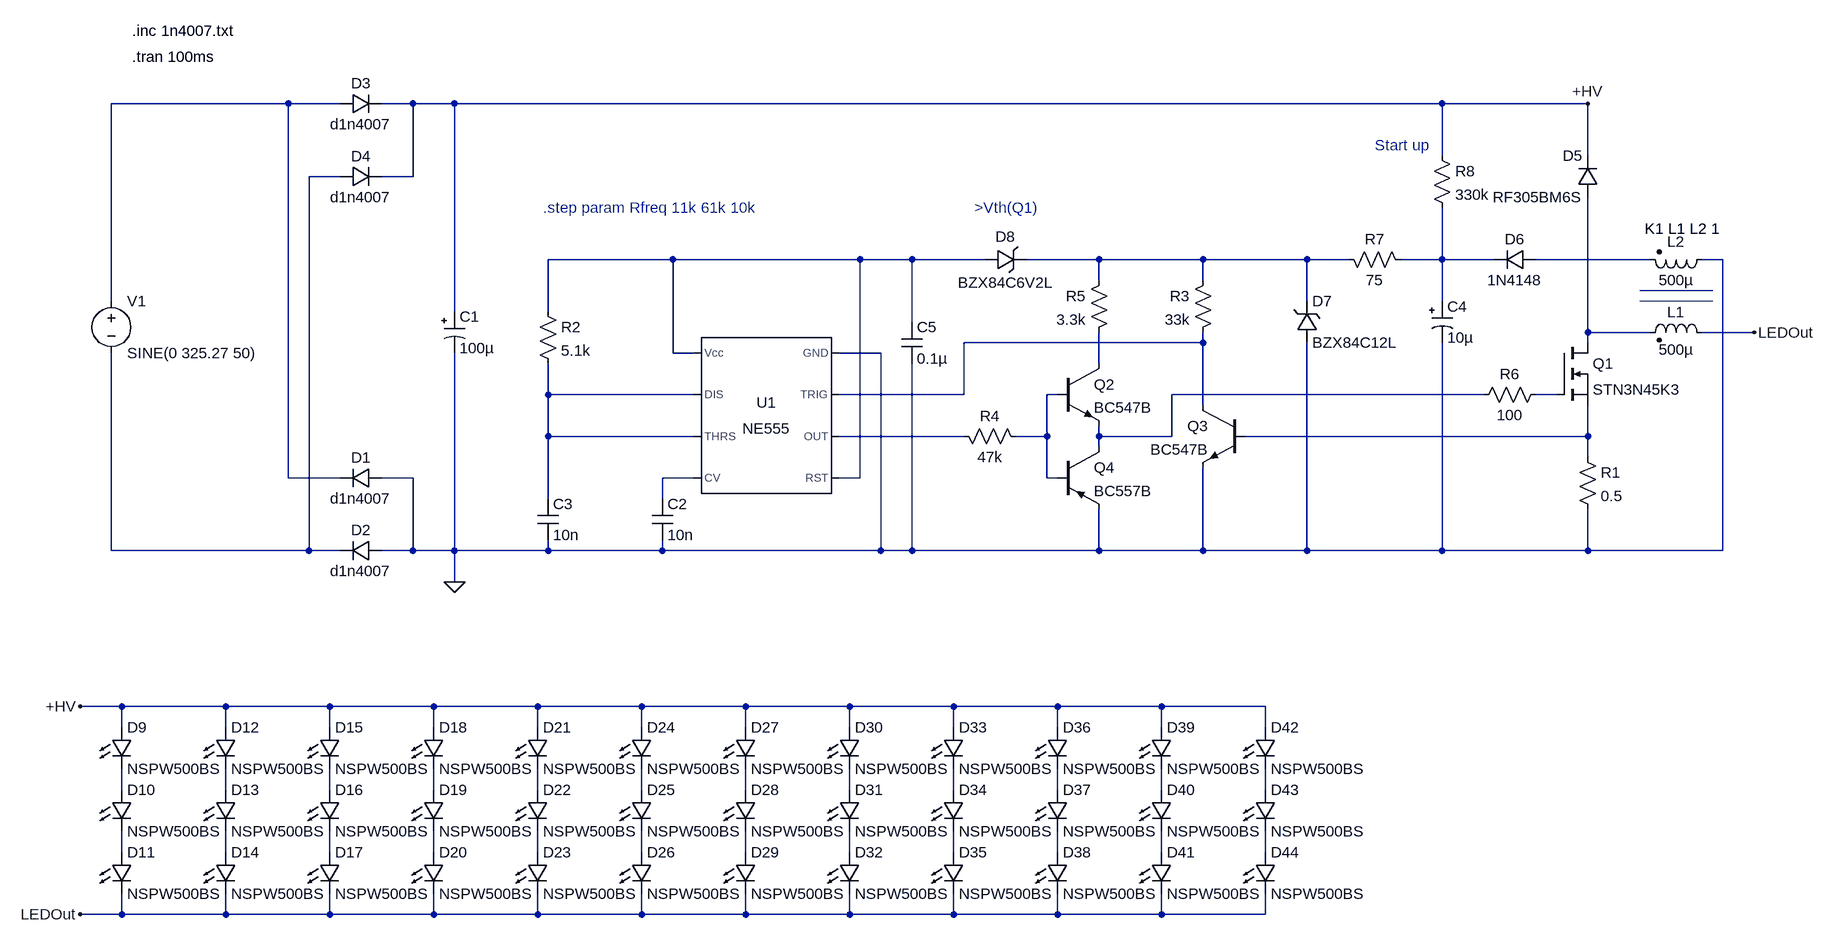
[diagram p0: schematic AC LED Driver LoV.asc]
AC LED Driver LoV.asc, the LTspice schematic file:
Version 4
SHEET 1 4020 1492
WIRE 736 -16 464 -16
WIRE 816 -16 736 -16
WIRE 928 -16 880 -16
WIRE 992 -16 928 -16
WIRE 2512 -16 992 -16
WIRE 2736 -16 2512 -16
WIRE 2512 64 2512 -16
WIRE 2736 64 2736 -16
WIRE 816 96 768 96
WIRE 928 96 928 -16
WIRE 928 96 880 96
WIRE 1328 224 1136 224
WIRE 1616 224 1328 224
WIRE 1696 224 1616 224
WIRE 1808 224 1696 224
WIRE 1984 224 1872 224
WIRE 2144 224 1984 224
WIRE 2304 224 2144 224
WIRE 2368 224 2304 224
WIRE 2512 224 2512 144
WIRE 2512 224 2448 224
WIRE 2592 224 2512 224
WIRE 2832 224 2656 224
WIRE 2944 224 2912 224
WIRE 1984 256 1984 224
WIRE 2144 256 2144 224
WIRE 464 288 464 -16
WIRE 2304 288 2304 224
WIRE 2512 288 2512 224
WIRE 992 304 992 -16
WIRE 1136 304 1136 224
WIRE 1696 320 1696 224
WIRE 2736 336 2736 128
WIRE 2832 336 2736 336
WIRE 2992 336 2912 336
WIRE 2144 352 2144 336
WIRE 2144 352 1776 352
WIRE 2736 352 2736 336
WIRE 1328 368 1328 224
WIRE 1360 368 1328 368
WIRE 1648 368 1584 368
WIRE 1984 384 1984 336
WIRE 1136 432 1136 384
WIRE 1360 432 1136 432
WIRE 1776 432 1776 352
WIRE 1776 432 1584 432
WIRE 1920 432 1904 432
WIRE 2576 432 2096 432
WIRE 2688 432 2656 432
WIRE 2144 448 2144 352
WIRE 1136 496 1136 432
WIRE 1360 496 1136 496
WIRE 1776 496 1584 496
WIRE 1904 496 1904 432
WIRE 1904 496 1856 496
WIRE 1984 496 1984 480
WIRE 2096 496 2096 432
WIRE 2096 496 1984 496
WIRE 2736 496 2736 448
WIRE 2736 496 2208 496
WIRE 1984 512 1984 496
WIRE 2736 528 2736 496
WIRE 736 560 736 -16
WIRE 816 560 736 560
WIRE 928 560 880 560
WIRE 1360 560 1312 560
WIRE 1616 560 1616 224
WIRE 1616 560 1584 560
WIRE 1904 560 1904 496
WIRE 1920 560 1904 560
WIRE 1136 592 1136 496
WIRE 1312 592 1312 560
WIRE 464 672 464 368
WIRE 768 672 768 96
WIRE 768 672 464 672
WIRE 816 672 768 672
WIRE 928 672 928 560
WIRE 928 672 880 672
WIRE 992 672 992 368
WIRE 992 672 928 672
WIRE 1136 672 1136 656
WIRE 1136 672 992 672
WIRE 1312 672 1312 656
WIRE 1312 672 1136 672
WIRE 1648 672 1648 368
WIRE 1648 672 1312 672
WIRE 1696 672 1696 384
WIRE 1696 672 1648 672
WIRE 1984 672 1984 608
WIRE 1984 672 1696 672
WIRE 2144 672 2144 544
WIRE 2144 672 1984 672
WIRE 2304 672 2304 352
WIRE 2304 672 2144 672
WIRE 2512 672 2512 352
WIRE 2512 672 2304 672
WIRE 2736 672 2736 608
WIRE 2736 672 2512 672
WIRE 2944 672 2944 224
WIRE 2944 672 2736 672
WIRE 992 720 992 672
WIRE 480 912 416 912
WIRE 640 912 480 912
WIRE 800 912 640 912
WIRE 960 912 800 912
WIRE 1120 912 960 912
WIRE 1280 912 1120 912
WIRE 1440 912 1280 912
WIRE 1600 912 1440 912
WIRE 1760 912 1600 912
WIRE 1920 912 1760 912
WIRE 2080 912 1920 912
WIRE 2240 912 2080 912
WIRE 480 944 480 912
WIRE 640 944 640 912
WIRE 800 944 800 912
WIRE 960 944 960 912
WIRE 1120 944 1120 912
WIRE 1280 944 1280 912
WIRE 1440 944 1440 912
WIRE 1600 944 1600 912
WIRE 1760 944 1760 912
WIRE 1920 944 1920 912
WIRE 2080 944 2080 912
WIRE 2240 944 2240 912
WIRE 480 1040 480 1008
WIRE 640 1040 640 1008
WIRE 800 1040 800 1008
WIRE 960 1040 960 1008
WIRE 1120 1040 1120 1008
WIRE 1280 1040 1280 1008
WIRE 1440 1040 1440 1008
WIRE 1600 1040 1600 1008
WIRE 1760 1040 1760 1008
WIRE 1920 1040 1920 1008
WIRE 2080 1040 2080 1008
WIRE 2240 1040 2240 1008
WIRE 480 1136 480 1104
WIRE 640 1136 640 1104
WIRE 800 1136 800 1104
WIRE 960 1136 960 1104
WIRE 1120 1136 1120 1104
WIRE 1280 1136 1280 1104
WIRE 1440 1136 1440 1104
WIRE 1600 1136 1600 1104
WIRE 1760 1136 1760 1104
WIRE 1920 1136 1920 1104
WIRE 2080 1136 2080 1104
WIRE 2240 1136 2240 1104
WIRE 480 1232 480 1200
WIRE 480 1232 416 1232
WIRE 640 1232 640 1200
WIRE 640 1232 480 1232
WIRE 800 1232 800 1200
WIRE 800 1232 640 1232
WIRE 960 1232 960 1200
WIRE 960 1232 800 1232
WIRE 1120 1232 1120 1200
WIRE 1120 1232 960 1232
WIRE 1280 1232 1280 1200
WIRE 1280 1232 1120 1232
WIRE 1440 1232 1440 1200
WIRE 1440 1232 1280 1232
WIRE 1600 1232 1600 1200
WIRE 1600 1232 1440 1232
WIRE 1760 1232 1760 1200
WIRE 1760 1232 1600 1232
WIRE 1920 1232 1920 1200
WIRE 1920 1232 1760 1232
WIRE 2080 1232 2080 1200
WIRE 2080 1232 1920 1232
WIRE 2240 1232 2240 1200
WIRE 2240 1232 2080 1232
FLAG 992 720 0
FLAG 416 912 +HV
FLAG 416 1232 LEDOut
FLAG 2736 -16 +HV
FLAG 2992 336 LEDOut
SYMBOL voltage 464 272 R0
WINDOW 123 0 0 Left 2
WINDOW 39 0 0 Left 2
SYMATTR InstName V1
SYMATTR Value SINE(0 325.27 50)
SYMBOL diode 880 544 R90
WINDOW 0 0 32 VBottom 2
WINDOW 3 32 32 VTop 2
SYMATTR InstName D1
SYMATTR Value d1n4007
SYMBOL diode 880 656 R90
WINDOW 0 0 32 VBottom 2
WINDOW 3 32 32 VTop 2
SYMATTR InstName D2
SYMATTR Value d1n4007
SYMBOL diode 816 0 R270
WINDOW 0 32 32 VTop 2
WINDOW 3 0 32 VBottom 2
SYMATTR InstName D3
SYMATTR Value d1n4007
SYMBOL diode 816 112 R270
WINDOW 0 32 32 VTop 2
WINDOW 3 0 32 VBottom 2
SYMATTR InstName D4
SYMATTR Value d1n4007
SYMBOL polcap 976 304 R0
SYMATTR InstName C1
SYMATTR Value 100µ
SYMBOL nmos 2688 352 R0
SYMATTR InstName Q1
SYMATTR Value STN3N45K3
SYMBOL ind2 2928 352 M270
WINDOW 0 32 56 VTop 2
WINDOW 3 5 56 VBottom 2
SYMATTR InstName L1
SYMATTR Value 500µ
SYMATTR Type ind
SYMBOL diode 2752 128 R180
WINDOW 0 24 64 Left 2
WINDOW 3 24 0 Left 2
SYMATTR InstName D5
SYMATTR Value RF305BM6S
SYMBOL res 2720 512 R0
SYMATTR InstName R1
SYMATTR Value 0.5
SYMBOL npn 1920 384 R0
SYMATTR InstName Q2
SYMATTR Value BC547B
SYMBOL cap 1296 592 R0
SYMATTR InstName C2
SYMATTR Value 10n
SYMBOL cap 1120 592 R0
SYMATTR InstName C3
SYMATTR Value 10n
SYMBOL res 1120 288 R0
SYMATTR InstName R2
SYMATTR Value 5.1k
SYMBOL npn 2208 448 M0
SYMATTR InstName Q3
SYMATTR Value BC547B
SYMBOL res 2160 240 M0
SYMATTR InstName R3
SYMATTR Value 33k
SYMBOL res 1760 480 M90
WINDOW 0 0 56 VBottom 2
WINDOW 3 32 56 VTop 2
SYMATTR InstName R4
SYMATTR Value 47k
SYMBOL res 2000 240 M0
SYMATTR InstName R5
SYMATTR Value 3.3k
SYMBOL res 2560 448 R270
WINDOW 0 32 56 VTop 2
WINDOW 3 0 56 VBottom 2
SYMATTR InstName R6
SYMATTR Value 100
SYMBOL Misc\\NE555 1472 464 M0
SYMATTR InstName U1
SYMBOL ind2 2928 208 R90
WINDOW 0 4 56 VBottom 2
WINDOW 3 32 56 VTop 2
SYMATTR InstName L2
SYMATTR Value 500µ
SYMATTR Type ind
SYMBOL diode 2656 208 R90
WINDOW 0 0 32 VBottom 2
WINDOW 3 32 32 VTop 2
SYMATTR InstName D6
SYMATTR Value 1N4148
SYMBOL polcap 2496 288 R0
SYMATTR InstName C4
SYMATTR Value 10µ
SYMBOL res 2464 240 M270
WINDOW 0 32 56 VTop 2
WINDOW 3 0 56 VBottom 2
SYMATTR InstName R7
SYMATTR Value 75
SYMBOL zener 2288 352 M180
WINDOW 0 24 64 Left 2
WINDOW 3 24 0 Left 2
SYMATTR InstName D7
SYMATTR Value BZX84C12L
SYMBOL res 2496 48 R0
SYMATTR InstName R8
SYMATTR Value 330k
SYMBOL zener 1808 208 M90
WINDOW 0 -4 32 VBottom 2
WINDOW 3 36 32 VTop 2
SYMATTR InstName D8
SYMATTR Value BZX84C6V2L
SYMBOL cap 1680 320 R0
SYMATTR InstName C5
SYMATTR Value 0.1µ
SYMBOL LED 464 944 R0
SYMATTR InstName D9
SYMATTR Value NSPW500BS
SYMBOL LED 464 1040 R0
SYMATTR InstName D10
SYMATTR Value NSPW500BS
SYMBOL LED 464 1136 R0
SYMATTR InstName D11
SYMATTR Value NSPW500BS
SYMBOL LED 624 944 R0
SYMATTR InstName D12
SYMATTR Value NSPW500BS
SYMBOL LED 624 1040 R0
SYMATTR InstName D13
SYMATTR Value NSPW500BS
SYMBOL LED 624 1136 R0
SYMATTR InstName D14
SYMATTR Value NSPW500BS
SYMBOL LED 784 944 R0
SYMATTR InstName D15
SYMATTR Value NSPW500BS
SYMBOL LED 784 1040 R0
SYMATTR InstName D16
SYMATTR Value NSPW500BS
SYMBOL LED 784 1136 R0
SYMATTR InstName D17
SYMATTR Value NSPW500BS
SYMBOL LED 944 944 R0
SYMATTR InstName D18
SYMATTR Value NSPW500BS
SYMBOL LED 944 1040 R0
SYMATTR InstName D19
SYMATTR Value NSPW500BS
SYMBOL LED 944 1136 R0
SYMATTR InstName D20
SYMATTR Value NSPW500BS
SYMBOL LED 1104 944 R0
SYMATTR InstName D21
SYMATTR Value NSPW500BS
SYMBOL LED 1104 1040 R0
SYMATTR InstName D22
SYMATTR Value NSPW500BS
SYMBOL LED 1104 1136 R0
SYMATTR InstName D23
SYMATTR Value NSPW500BS
SYMBOL LED 1264 944 R0
SYMATTR InstName D24
SYMATTR Value NSPW500BS
SYMBOL LED 1264 1040 R0
SYMATTR InstName D25
SYMATTR Value NSPW500BS
SYMBOL LED 1264 1136 R0
SYMATTR InstName D26
SYMATTR Value NSPW500BS
SYMBOL LED 1424 944 R0
SYMATTR InstName D27
SYMATTR Value NSPW500BS
SYMBOL LED 1424 1040 R0
SYMATTR InstName D28
SYMATTR Value NSPW500BS
SYMBOL LED 1424 1136 R0
SYMATTR InstName D29
SYMATTR Value NSPW500BS
SYMBOL LED 1584 944 R0
SYMATTR InstName D30
SYMATTR Value NSPW500BS
SYMBOL LED 1584 1040 R0
SYMATTR InstName D31
SYMATTR Value NSPW500BS
SYMBOL LED 1584 1136 R0
SYMATTR InstName D32
SYMATTR Value NSPW500BS
SYMBOL LED 1744 944 R0
SYMATTR InstName D33
SYMATTR Value NSPW500BS
SYMBOL LED 1744 1040 R0
SYMATTR InstName D34
SYMATTR Value NSPW500BS
SYMBOL LED 1744 1136 R0
SYMATTR InstName D35
SYMATTR Value NSPW500BS
SYMBOL LED 1904 944 R0
SYMATTR InstName D36
SYMATTR Value NSPW500BS
SYMBOL LED 1904 1040 R0
SYMATTR InstName D37
SYMATTR Value NSPW500BS
SYMBOL LED 1904 1136 R0
SYMATTR InstName D38
SYMATTR Value NSPW500BS
SYMBOL LED 2064 944 R0
SYMATTR InstName D39
SYMATTR Value NSPW500BS
SYMBOL LED 2064 1040 R0
SYMATTR InstName D40
SYMATTR Value NSPW500BS
SYMBOL LED 2064 1136 R0
SYMATTR InstName D41
SYMATTR Value NSPW500BS
SYMBOL LED 2224 944 R0
SYMATTR InstName D42
SYMATTR Value NSPW500BS
SYMBOL LED 2224 1040 R0
SYMATTR InstName D43
SYMATTR Value NSPW500BS
SYMBOL LED 2224 1136 R0
SYMATTR InstName D44
SYMATTR Value NSPW500BS
SYMBOL pnp 1920 512 R0
SYMATTR InstName Q4
SYMATTR Value BC557B
TEXT 496 -88 Left 2 !.tran 100ms
TEXT 496 -128 Left 2 !.inc 1n4007.txt
TEXT 2824 176 Left 2 !K1 L1 L2 1
TEXT 1128 144 Left 2 ;.step param Rfreq 11k 61k 10k
TEXT 1792 144 Left 2 ;>Vth(Q1)
TEXT 2408 48 Left 2 ;Start up
LINE Normal 2928 272 2816 272
LINE Normal 2928 288 2816 288

The netlist it stands for:
* AC LED Driver LoV.asc
V1 N001 N002 SINE(0 325.27 50)
D1 0 N001 d1n4007
D2 0 N002 d1n4007
D3 N001 +HV d1n4007
D4 N002 +HV d1n4007
C1 +HV 0 100µ
M§Q1 N007 N013 N015 N015 STN3N45K3
L1 LEDOut N007 500µ
D5 N007 +HV RF305BM6S
R1 N015 0 0.5
Q2 N009 N011 N012 0 BC547B
C2 N016 0 10n
C3 N010 0 10n
R2 N003 N010 5.1k
Q3 N008 N015 0 0 BC547B
R3 N004 N008 33k
R4 N014 N011 47k
R5 N004 N009 3.3k
R6 N012 N013 100
XU1 0 N008 N014 N003 N016 N010 N010 N003 NE555  ; pins GND TRIG OUT RST CV THRS DIS Vcc
L2 0 N006 500µ
D6 N006 N005 1N4148
C4 N005 0 10µ
R7 N005 N004 75
D7 0 N004 BZX84C12L
R8 +HV N005 330k
D8 N003 N004 BZX84C6V2L
C5 N003 0 0.1µ
D9 +HV N017 NSPW500BS
D10 N017 N029 NSPW500BS
D11 N029 LEDOut NSPW500BS
D12 +HV N018 NSPW500BS
D13 N018 N030 NSPW500BS
D14 N030 LEDOut NSPW500BS
D15 +HV N019 NSPW500BS
D16 N019 N031 NSPW500BS
D17 N031 LEDOut NSPW500BS
D18 +HV N020 NSPW500BS
D19 N020 N032 NSPW500BS
D20 N032 LEDOut NSPW500BS
D21 +HV N021 NSPW500BS
D22 N021 N033 NSPW500BS
D23 N033 LEDOut NSPW500BS
D24 +HV N022 NSPW500BS
D25 N022 N034 NSPW500BS
D26 N034 LEDOut NSPW500BS
D27 +HV N023 NSPW500BS
D28 N023 N035 NSPW500BS
D29 N035 LEDOut NSPW500BS
D30 +HV N024 NSPW500BS
D31 N024 N036 NSPW500BS
D32 N036 LEDOut NSPW500BS
D33 +HV N025 NSPW500BS
D34 N025 N037 NSPW500BS
D35 N037 LEDOut NSPW500BS
D36 +HV N026 NSPW500BS
D37 N026 N038 NSPW500BS
D38 N038 LEDOut NSPW500BS
D39 +HV N027 NSPW500BS
D40 N027 N039 NSPW500BS
D41 N039 LEDOut NSPW500BS
D42 +HV N028 NSPW500BS
D43 N028 N040 NSPW500BS
D44 N040 LEDOut NSPW500BS
Q4 N012 N011 0 0 BC557B
.model D D
.lib standard.dio
.model NPN NPN
.model PNP PNP
.lib standard.bjt
.model NMOS NMOS
.model PMOS PMOS
.lib standard.mos
.tran 100ms
.inc 1n4007.txt
K1 L1 L2 1
* .step param Rfreq 11k 61k 10k
* >Vth(Q1)
* Start up
.lib NE555.sub
.backanno
.end